# Altium schematic sheet PMIC_RK809_RK3566_DDR4.SchDoc
size A3
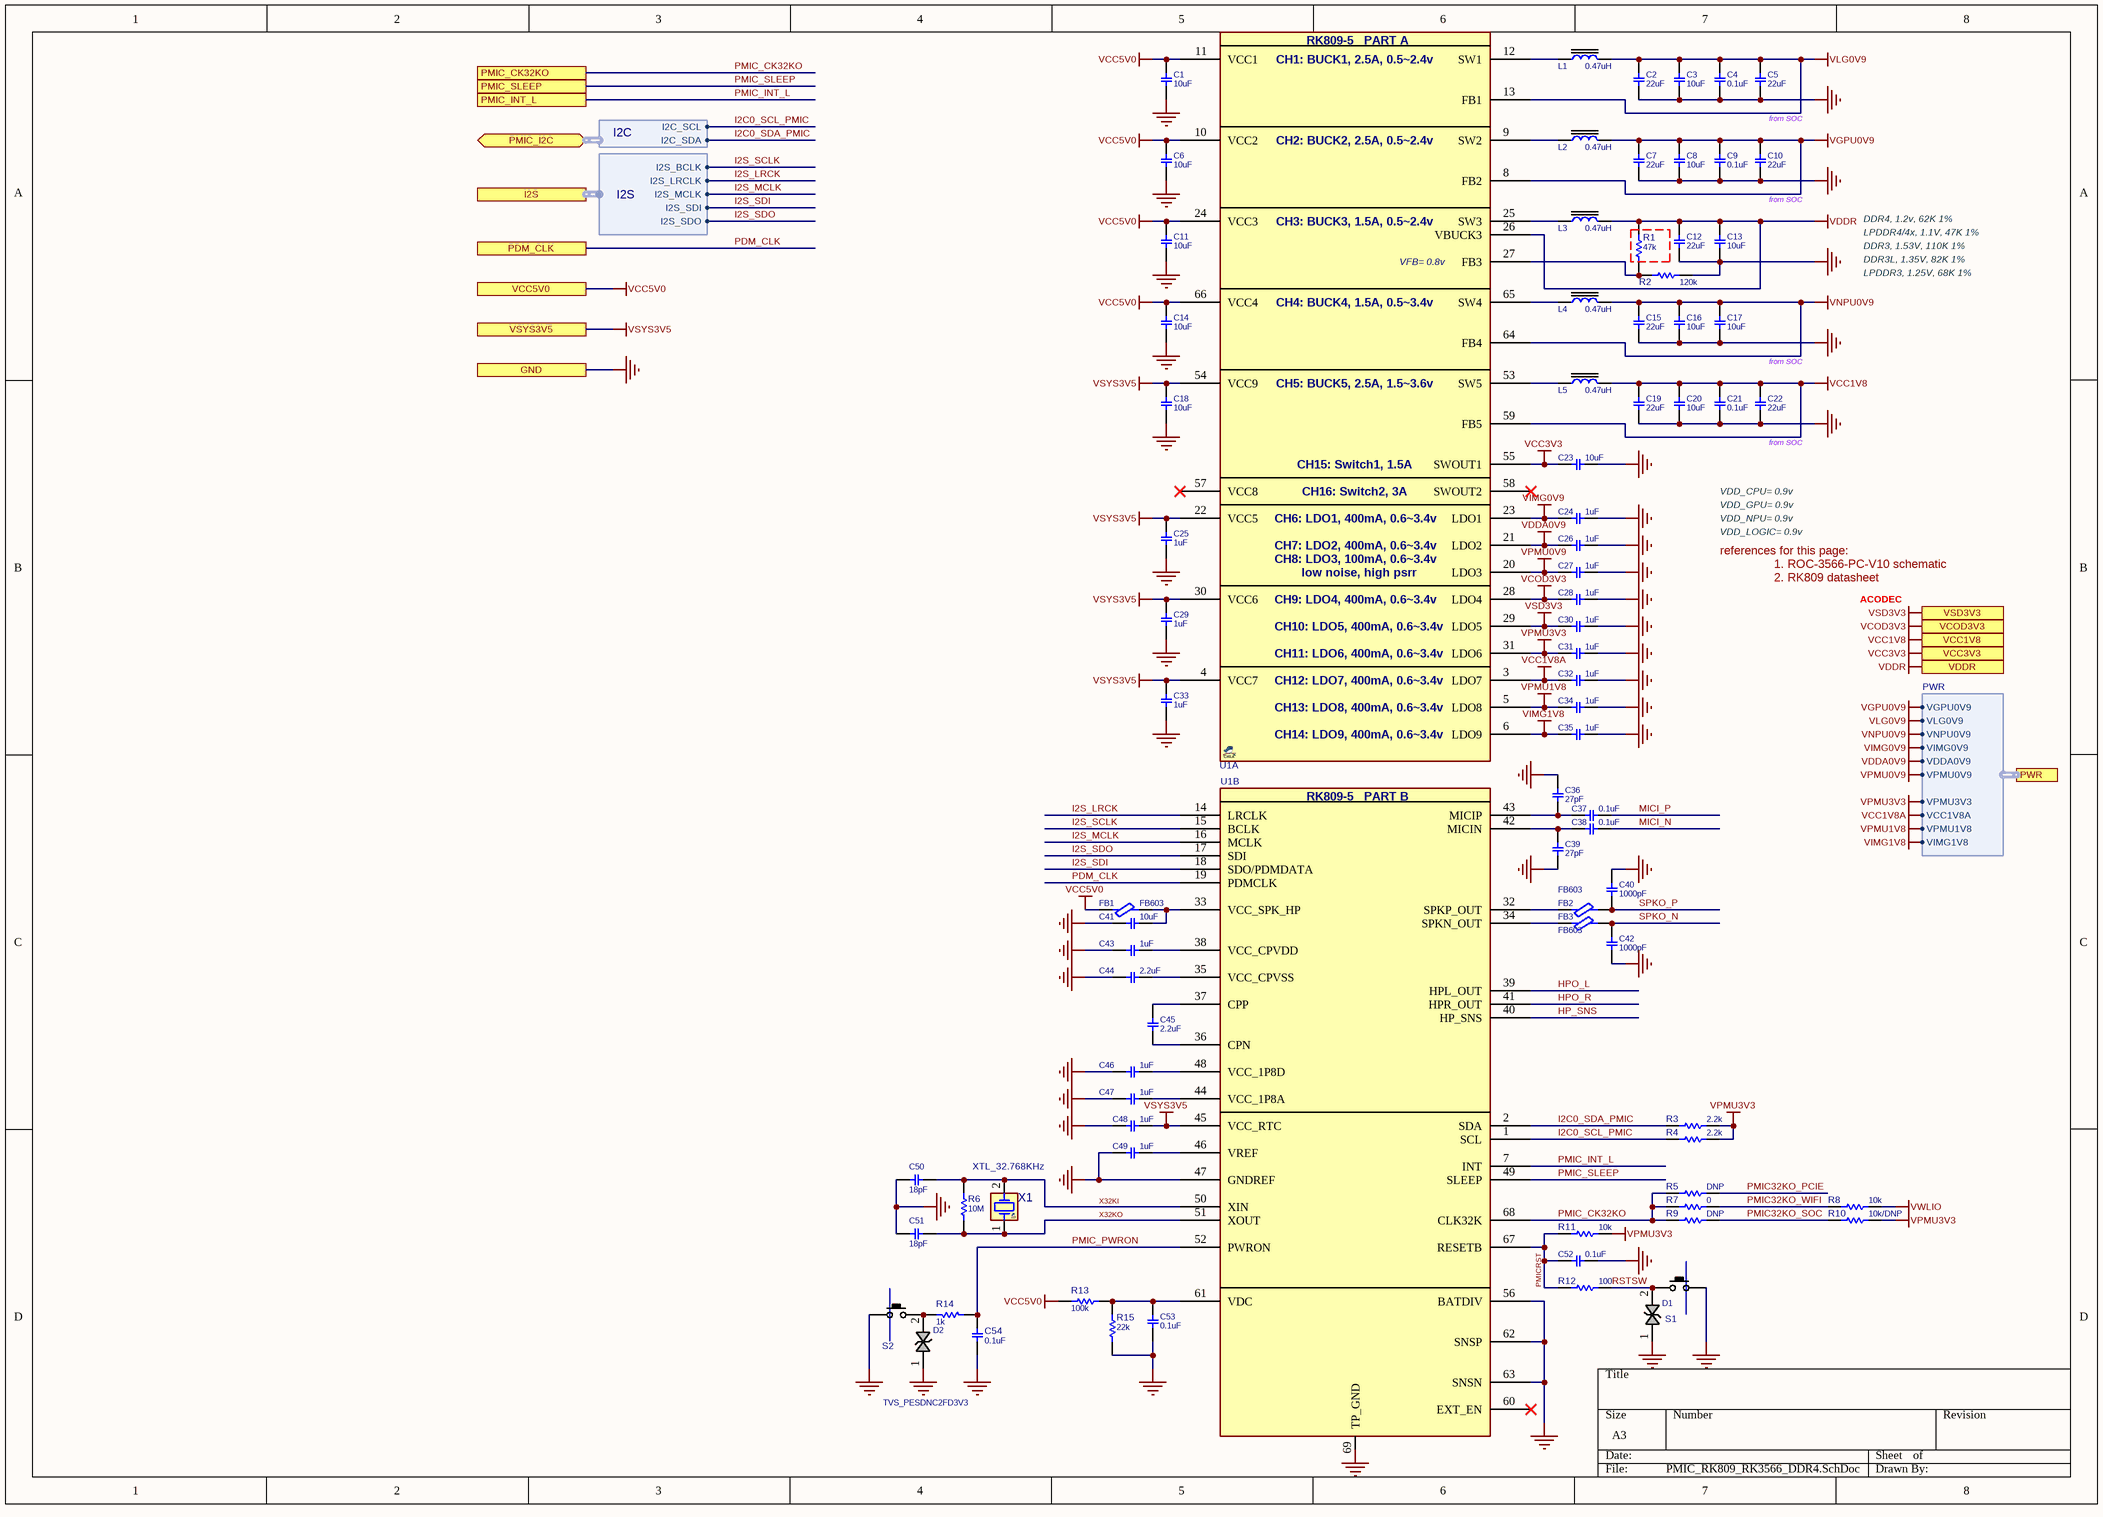
[diagram p0: PMIC_RK809_RK3566_DDR4.SchDoc]

## Parts
C1  10uF  [C0402]
C2  22uF  [C0402]
C3  10uF  [C0402]
C4  0.1uF  [C0402]
C5  22uF  [C0402]
C6  10uF  [C0402]
C7  22uF  [C0402]
C8  10uF  [C0402]
C9  0.1uF  [C0402]
C10  22uF  [C0402]
C11  10uF  [C0402]
C12  22uF  [C0402]
C13  10uF  [C0402]
C14  10uF  [C0402]
C15  22uF  [C0402]
C16  10uF  [C0402]
C17  10uF  [C0402]
C18  10uF  [C0402]
C19  22uF  [C0402]
C20  10uF  [C0402]
C21  0.1uF  [C0402]
C22  22uF  [C0402]
C23  10uF  [C0402]
C24  1uF  [C0402]
C25  1uF  [C0402]
C26  1uF  [C0402]
C27  1uF  [C0402]
C28  1uF  [C0402]
C29  1uF  [C0402]
C30  1uF  [C0402]
C31  1uF  [C0402]
C32  1uF  [C0402]
C33  1uF  [C0402]
C34  1uF  [C0402]
C35  1uF  [C0402]
C36  27pF  [C0402]
C37  0.1uF  [C0402]
C38  0.1uF  [C0402]
C39  27pF  [C0402]
C40  1000pF  [C0402]
C41  10uF  [C0402]
C42  1000pF  [C0402]
C43  1uF  [C0402]
C44  2.2uF  [C0402]
C45  2.2uF  [C0402]
C46  1uF  [C0402]
C47  1uF  [C0402]
C48  1uF  [C0402]
C49  1uF  [C0402]
C50  18pF  [C0402]
C51  18pF  [C0402]
C52  0.1uF  [C0402]
C53  0.1uF  [C0402]
C54  0.1uF  [C0402]
D1  TVS_PESDNC2FD3V3  [ESD0402]  (value not drawn)
D2  TVS_PESDNC2FD3V3  [ESD0402]
FB1  FB603  [L0603]
FB2  FB603  [L0603]
FB3  FB603  [L0603]
L1  0.47uH  [L0806]
L2  0.47uH  [L0806]
L3  0.47uH  [L0806]
L4  0.47uH  [L0806]
L5  0.47uH  [L0806]
R1  47k  [R0402]
R2  120k  [R0402]
R3  2.2k  [R0402]
R4  2.2k  [R0402]
R5  DNP  [R0402]
R6  10M  [R0402]
R7  0  [R0402]
R8  10k  [R0402]
R9  DNP  [R0402]
R10  10k/DNP  [R0402]
R11  10k  [R0402]
R12  100  [R0402]
R13  100k  [R0402]
R14  1k  [R0402]
R15  22k  [R0402]
S1  PUSHBUTTON  [SWPBS_SPST_3X2X1]  (value not drawn)
S2  PUSHBUTTON  [SWPBS_SPST_3X2X1]  (value not drawn)
U1  RK809-5  [QFN35_68T]  (value not drawn)  (parts A,B of 2)
X1  XTL_32.768KHz  [XTL_2_1610]

## Ports
GND, I2S (harness I2S), PDM_CLK, PMIC_CK32KO, PMIC_I2C (bidir, harness I2C), PMIC_INT_L, PMIC_SLEEP, PWR (harness PWR), VCC1V8, VCC3V3, VCC5V0, VCOD3V3, VDDR, VSD3V3, VSYS3V5

## Harnesses
PWR: VGPU0V9, VLG0V9, VNPU0V9, VIMG0V9, VDDA0V9, VPMU0V9, VPMU3V3, VCC1V8A, VPMU1V8, VIMG1V8
I2C: I2C_SCL, I2C_SDA
I2S: I2S_BCLK, I2S_LRCLK, I2S_MCLK, I2S_SDI, I2S_SDO

## Nets
GND: C1.1 C2.1 C3.1 C4.1 C5.1 C6.1 C7.1 C8.1 C9.1 C10.1 C11.1 C12.1 C13.1 C14.1 C15.1 C16.1 C17.1 C18.1 C19.1 C20.1 C21.1 C22.1 C23.1 C24.1 C25.1 C26.1 C27.1 C28.1 C29.1 C30.1 C31.1 C32.1 C33.1 C34.1 C35.1 C36.1 C39.2 C40.1 C41.1 C42.2 C43.2 C44.2 C46.2 C47.2 C48.2 C49.2 C50.2 C51.2 C52.2 C53.1 C54.2 D1.1 D2.1 R2.1 R15.2 S1.2(P3) S2.2(P3) U1.47(GNDREF) U1.56(BATDIV) U1.62(SNSP) U1.63(SNSN) U1.69(TP_GND) ; port GND
VCC1V8: C19.2 C20.2 C21.2 C22.2 L5.2 U1.59(FB5) ; port VCC1V8
VCC1V8A: C32.2 U1.3(LDO7) ; port PWR.VCC1V8A
VCC3V3: C23.2 U1.55(SWOUT1) ; port VCC3V3
VCC5V0: C1.2 C6.2 C11.2 C14.2 FB1.1 R13.2 U1.10(VCC2) U1.11(VCC1) U1.24(VCC3) U1.66(VCC4) ; port VCC5V0
VCOD3V3: C28.2 U1.28(LDO4) ; port VCOD3V3
VDDA0V9: C26.2 U1.21(LDO2) ; port PWR.VDDA0V9
VDDR: C12.2 C13.2 L3.2 R1.2 U1.26(VBUCK3) ; port VDDR
VGPU0V9: C7.2 C8.2 C9.2 C10.2 L2.2 U1.8(FB2) ; port PWR.VGPU0V9
VIMG0V9: C24.2 U1.23(LDO1) ; port PWR.VIMG0V9
VIMG1V8: C35.2 U1.6(LDO9) ; port PWR.VIMG1V8
VLG0V9: C2.2 C3.2 C4.2 C5.2 L1.2 U1.13(FB1) ; port PWR.VLG0V9
VNPU0V9: C15.2 C16.2 C17.2 L4.2 U1.64(FB4) ; port PWR.VNPU0V9
VPMU0V9: C27.2 U1.20(LDO3) ; port PWR.VPMU0V9
VPMU1V8: C34.2 U1.5(LDO8) ; port PWR.VPMU1V8
VPMU3V3: C31.2 R3.1 R4.1 R10.1 R11.2 U1.31(LDO6) ; port PWR.VPMU3V3
VSD3V3: C30.2 U1.29(LDO5) ; port VSD3V3
VSYS3V5: C18.2 C25.2 C29.2 C33.2 C48.1 U1.4(VCC7) U1.22(VCC5) U1.30(VCC6) U1.45(VCC_RTC) U1.54(VCC9) ; port VSYS3V5
VWLIO: R8.1
HP_SNS: U1.40(HP_SNS)
HPO_L: U1.39(HPL_OUT)
HPO_R: U1.41(HPR_OUT)
I2C0_SCL_PMIC: R4.2 U1.1(SCL) ; port PMIC_I2C.I2C_SCL
I2C0_SDA_PMIC: R3.2 U1.2(SDA) ; port PMIC_I2C.I2C_SDA
I2S_LRCK: U1.14(LRCLK) ; port I2S.I2S_LRCLK
I2S_MCLK: U1.16(MCLK) ; port I2S.I2S_MCLK
I2S_SCLK: U1.15(BCLK) ; port I2S.I2S_BCLK
I2S_SDI: U1.18(SDO/PDMDATA) ; port I2S.I2S_SDI
I2S_SDO: U1.17(SDI) ; port I2S.I2S_SDO
MICI_N: C38.1
MICI_P: C37.1
PDM_CLK: U1.19(PDMCLK) ; port PDM_CLK
PMIC32KO_PCIE: R5.1
PMIC32KO_SOC: R9.1 R10.2
PMIC32KO_WIFI: R7.1 R8.2
PMIC_CK32KO: R5.2 R7.2 R9.2 U1.68(CLK32K) ; port PMIC_CK32KO
PMIC_INT_L: U1.7(INT) ; port PMIC_INT_L
PMIC_PWRON: C54.1 R14.2 U1.52(PWRON)
PMIC_SLEEP: U1.49(SLEEP) ; port PMIC_SLEEP
PMICRST: C52.1 R11.1 R12.1 U1.67(RESETB)
RSTSW: D1.2 R12.2 S1.1(P1)
SPKO_N: C42.1 FB3.2
SPKO_P: C40.2 FB2.2
X32KI: C50.1 R6.2 U1.50(XIN) X1.2(OSC2)
X32KO: C51.1 R6.1 U1.51(XOUT) X1.1(OSC1)
NetC36_2: C36.2 C37.2 U1.43(MICIP)
NetC38_2: C38.2 C39.1 U1.42(MICIN)
NetC41_2: C41.2 FB1.2 U1.33(VCC_SPK_HP)
NetC43_1: C43.1 U1.38(VCC_CPVDD)
NetC44_1: C44.1 U1.35(VCC_CPVSS)
NetC45_1: C45.1 U1.36(CPN)
NetC45_2: C45.2 U1.37(CPP)
NetC46_1: C46.1 U1.48(VCC_1P8D)
NetC47_1: C47.1 U1.44(VCC_1P8A)
NetC49_1: C49.1 U1.46(VREF)
NetC53_2: C53.2 R13.1 R15.1 U1.61(VDC)
NetD2_2: D2.2 R14.1 S2.1(P1)
NetFB2_1: FB2.1 U1.32(SPKP_OUT)
NetFB3_1: FB3.1 U1.34(SPKN_OUT)
NetL1_1: L1.1 U1.12(SW1)
NetL2_1: L2.1 U1.9(SW2)
NetL3_1: L3.1 U1.25(SW3)
NetL4_1: L4.1 U1.65(SW4)
NetL5_1: L5.1 U1.53(SW5)
NetR1_1: R1.1 R2.2 U1.27(FB3)

Not connected (* = marked no-connect by the designer): U1 57(VCC8)* 58(SWOUT2)* 60(EXT_EN)*

## Notes on the sheet
- from SOC
- (near C10) from SOC
- DDR4, 1.2v, 62K 1%
- LPDDR4/4x, 1.1V, 47K 1%
- DDR3, 1.53V, 110K 1%
- DDR3L, 1.35V, 82K 1%
- LPDDR3, 1.25V, 68K 1%
- (near C22) from SOC
- VDD_CPU= 0.9v
- VDD_GPU= 0.9v
- VDD_NPU= 0.9v
- references for this page:
- VDD_LOGIC= 0.9v
- 1. ROC-3566-PC-V10 schematic
- 2. RK809 datasheet
- ACODEC
- (in symbol RK809-5_QFN68, part A) RK809-5   PART A; CH1: BUCK1, 2.5A, 0.5~2.4v; CH2: BUCK2, 2.5A, 0.5~2.4v; CH3: BUCK3, 1.5A, 0.5~2.4v; VFB= 0.8v; CH4: BUCK4, 1.5A, 0.5~3.4v; CH5: BUCK5, 2.5A, 1.5~3.6v; CH15: Switch1, 1.5A; CH16: Switch2, 3A; CH6: LDO1, 400mA, 0.6~3.4v; CH7: LDO2, 400mA, 0.6~3.4v; CH8: LDO3, 100mA, 0.6~3.4v; low noise, high psrr; CH9: LDO4, 400mA, 0.6~3.4v; CH10: LDO5, 400mA, 0.6~3.4v; CH11: LDO6, 400mA, 0.6~3.4v; CH12: LDO7, 400mA, 0.6~3.4v; CH13: LDO8, 400mA, 0.6~3.4v; CH14: LDO9, 400mA, 0.6~3.4v
- (in symbol RK809-5_QFN68, part B) RK809-5   PART B

## Library data of the parts
C1 C3 C6 C8 C11 C13 C14 C16-C18 C20 C23 C41 = CAP_SMD_MLCC: CAP, MLCC; PARAM: X5R, 10%; MANF_P#: CL05A106MP5NUNC; MANF: Samsung; PARAM2: 10v; PRICE: 10,000: $0.034; ASSEMBLY: ASSEMBLY; VALUE: 10uF
C2 C5 C7 C10 C12 C15 C19 C22 = CAP_SMD_MLCC: CAP, MLCC; PARAM: X5R, 10%; MANF_P#: GRM158R61A226ME15; MANF: Murata; PARAM2: 10v; PRICE: 8,000: $0.124; ASSEMBLY: ASSEMBLY; VALUE: 22uF
C4 C9 C21 C37 C38 C52 C53 = CAP_SMD_MLCC: CAP, MLCC; PARAM: X5R, 10%; MANF_P#: GRM155R61E104; MANF: Murata; PARAM2: 25v; PRICE: 10,000:	$0.006; ASSEMBLY: ASSEMBLY; VALUE: 0.1uF
C24-C35 C43 C46-C49 = CAP_SMD_MLCC: CAP, MLCC; PARAM: X5R, 10%; MANF_P#: CL05A105KO5NNND; MANF: Samsung; PARAM2: 16v; PRICE: 50,000:	$0.006; ASSEMBLY: ASSEMBLY; VALUE: 1uF
C36 C39 = CAP_SMD_MLCC: CAP, MLCC; PARAM: X5R, 10%; MANF_P#: CC0402JRNPO9BN270; MANF: Yageo; PARAM2: 10v; PRICE: 10,000: $0.034; ASSEMBLY: ASSEMBLY; VALUE: 27pF
C40 C42 = CAP_SMD_MLCC: CAP, MLCC; PARAM: X5R, 10%; MANF_P#: CC0402JRNPO9BN102; MANF: Yageo; PARAM2: 10v; PRICE: 10,000: $0.034; ASSEMBLY: ASSEMBLY; VALUE: 1000pF
C44 C45 = CAP_SMD_MLCC: CAP, MLCC; PARAM: X5R, 10%; MANF_P#: CL05A225MP5NNNC; MANF: Samsung; PARAM2: 10v; PRICE: 10,000: $0.034; ASSEMBLY: ASSEMBLY; VALUE: 2.2uF
C50 C51 = CAP_SMD_MLCC: CAP, MLCC; PARAM: C0G, 5%; MANF_P#: CC0402JRNPO9BN180; MANF: Yageo; PARAM2: 50v; PRICE: 100: 0.009$; ASSEMBLY: ASSEMBLY; VALUE: 18pF
C54 = CAP_SMD_MLCC_100n50TDK: CAP, MLCC; PARAM: X7R, 10%, -55~125oC; MANF_P#: GRM155R71H104KE14D; MANF: Murata; PARAM2: 50v; ASSEMBLY: ASSEMBLY; PRICE: 100: 0.018$; VALUE: 0.1uF
D1 D2 = TVS_PESDNC2FD3V3: TVS, ESD PROTECT, Bidirectional; MANF_P#: PESDNC2FD3V3BS; PARAM2: 3.3vb, 10.5vr; MANF: -; PRICE: 0.7$; VALUE: TVS_PESDNC2FD3V3
FB1 = FBEAD_SMD_BLM18KG601: FERRITE_Bead, 0603, 1.3A, 150mOhm, 600@100MHz; PARAM: 120@100MHz; PARAM2: 3A, 50mOhm; MANF_P#: ACMS160808A1213A; PRICE: 0.1$; VALUE: FB603
FB2 FB3 = FBEAD_SMD_BLM18KG601: FERRITE_Bead, 0603, 1.3A, 150mOhm, 600@100MHz; PARAM: 180@100MHz; PARAM2: 1.5A, 70mOhm; MANF_P#: CBM160808U181T; PRICE: 0.1$; VALUE: FB603
L1-L5 = IND_SMD_2.2uH_2.6A: INDUCTOR; PARAM: 3.6A, -40~125oC; MANF_P#: DFE201610E-R47M; MANF: Murata; PARAM2: 20%, 32mOhm; MANF_P#2: TFM201610GHM-R47M; PRICE: 500: $0.07; ASSEMBLY: ASSEMBLY; VALUE: 0.47uH
R1-R15 = RES_SMD: RESISTOR, SMD; PARAM: 0.063W; DESC: DESCRIPTION; DIST#: MOUSER; PARAM2: 1%; MANF_P#: -; MANF: -; ASSEMBLY: ASSEMBLY; PRICE: 100= 0.3$
  R1: VALUE: 47k
  R2: VALUE: 120k
  R3 R4: VALUE: 2.2k
  R5 R9: VALUE: DNP
  R6: VALUE: 10M
  R7: VALUE: 0
  R8 R11: VALUE: 10k
  R10: VALUE: 10k/DNP
  R12: VALUE: 100
  R13: VALUE: 100k
  R14: VALUE: 1k
  R15: VALUE: 22k
S1 S2 = SWPBS_SPST_3X2_B3U-1000P: SWITCH, PUSH BUTTON, TACTILE, SMD, SPST, 3X2.5X1.2mm; MANF: OMRON; DESC: DESCRIPTION; VALUE: PUSHBUTTON; ASSEMBLY: ASSEMBLY; PARAM: PARAM; PRICE: PRICE; MANF_P#: B3U-1000P
U1 = RK809-5_QFN68: IC, Regulator PMIC, for RK3566; MANF: Rockchip; PARAM2: 3.8~5.5VUSBinput, 2.7~5.5VBATinput, 5DCDC/9LDO/2SW; PARAM: RK3566, -40~85°C; MANF_P#: RK809-5; PRICE: -; VALUE: RK809-5
X1 = XTL_2_32.768_1610A: Crystal, 32.768KHz, 9pF, 20PPM; MANF: ABRACON; MANF_P#: ABS05-32.768KHZ-9-T; PARAM: -40~85oC; PARAM2: 9pF, 20PPM; PRICE: 0.8$; VALUE: XTL_32.768KHz